# Altium schematic sheet MicroSD.SchDoc: MicroSD
size A4; DocumentNumber: MB1144; Revision: C-02; SheetNumber: 14; SheetTotal: 25; Project: STM32L476G-EVAL; ModifiedDate: 9/23/2015
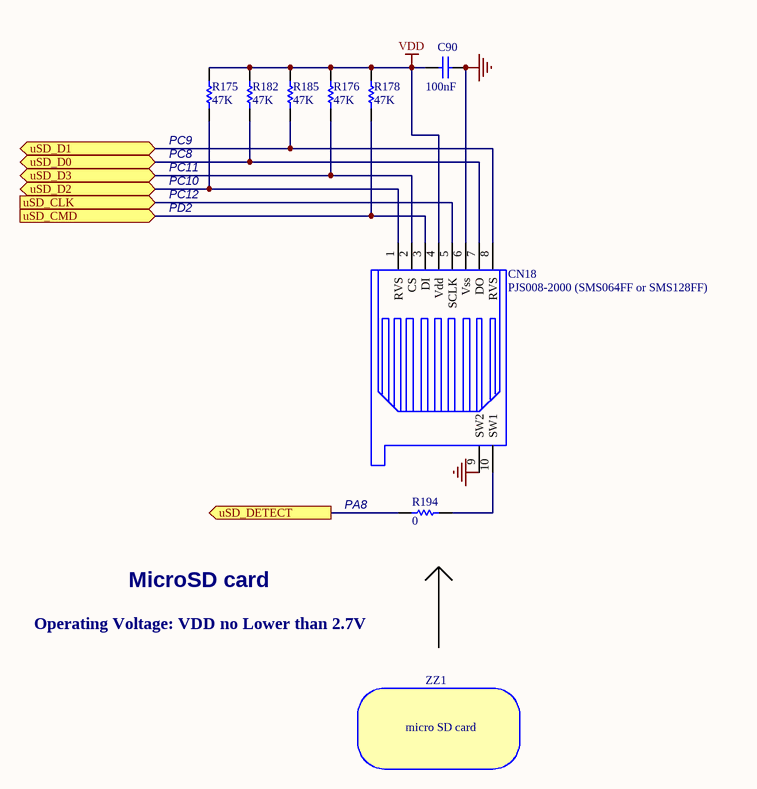
[diagram p0: MicroSD.SchDoc]

## Parts
C90  100nF  [0402C]
CN18  PJS008-2000 (SMS064FF or SMS128FF)  [MSD_PJS008_]
R175  47K  [0402R]
R176  47K  [0402R]
R178  47K  [0402R]
R182  47K  [0402R]
R185  47K  [0402R]
R194  0  [0603R]
ZZ1  micro SD card

## Ports
uSD_CLK (in), uSD_CMD (in), uSD_D0 (bidir), uSD_D1 (bidir), uSD_D2 (bidir), uSD_D3 (bidir), uSD_DETECT (out)

## Nets
GND: C90.2 CN18.6(Vss) CN18.9(SW2)
VDD: C90.1 CN18.4(Vdd) R175.1 R176.1 R178.1 R182.1 R185.1
uSD_CLK: CN18.5(SCLK) ; port uSD_CLK
uSD_CMD: CN18.3(DI) R178.2 ; port uSD_CMD
uSD_D0: CN18.7(DO) R182.2 ; port uSD_D0
uSD_D1: CN18.8(RVS) R185.2 ; port uSD_D1
uSD_D2: CN18.1(RVS) R175.2 ; port uSD_D2
uSD_D3: CN18.2(CS) R176.2 ; port uSD_D3
uSD_DETECT: R194.1 ; port uSD_DETECT
NetCN18_10: CN18.10(SW1) R194.2

## Notes on the sheet
- (near R175) PC9
- (near R175) PC8
- PC10
- PC11
- PC12
- PD2
- PA8
- MicroSD card
- Operating Voltage: VDD no Lower than 2.7V
- Title:
- Project:
- Size:
- Date:
- A4
- Reference:
- Sheet:
- Revision:
- of

## Library data of the parts
C90 = CAP: Capacitor; Value: 100pF; Ordered by: Subcon; ECCN_US/EU: NA; Published: 8-Jun-2000; Revision: July-2002: Re-released for DXP Platform.; Publisher: Altium Limited
CN18 = SMS016AFA5E: ECCN_US/EU: NA; Ordered by: Subcon; Assembly: with SD card; Comments: Micro SD card connector
R175 R176 R178 R182 R185 R194 = Res1: Resistor; Value: 1K; Ordered by: Subcon; ECCN_US/EU: NA; Published: 8-Jun-2000; Revision: July-2002: Re-released for DXP Platform.; Publisher: Altium Limited
ZZ1 = BoM_Item: 4GB or more; Ordered by: Subcon; Assembly: to plug in CN18